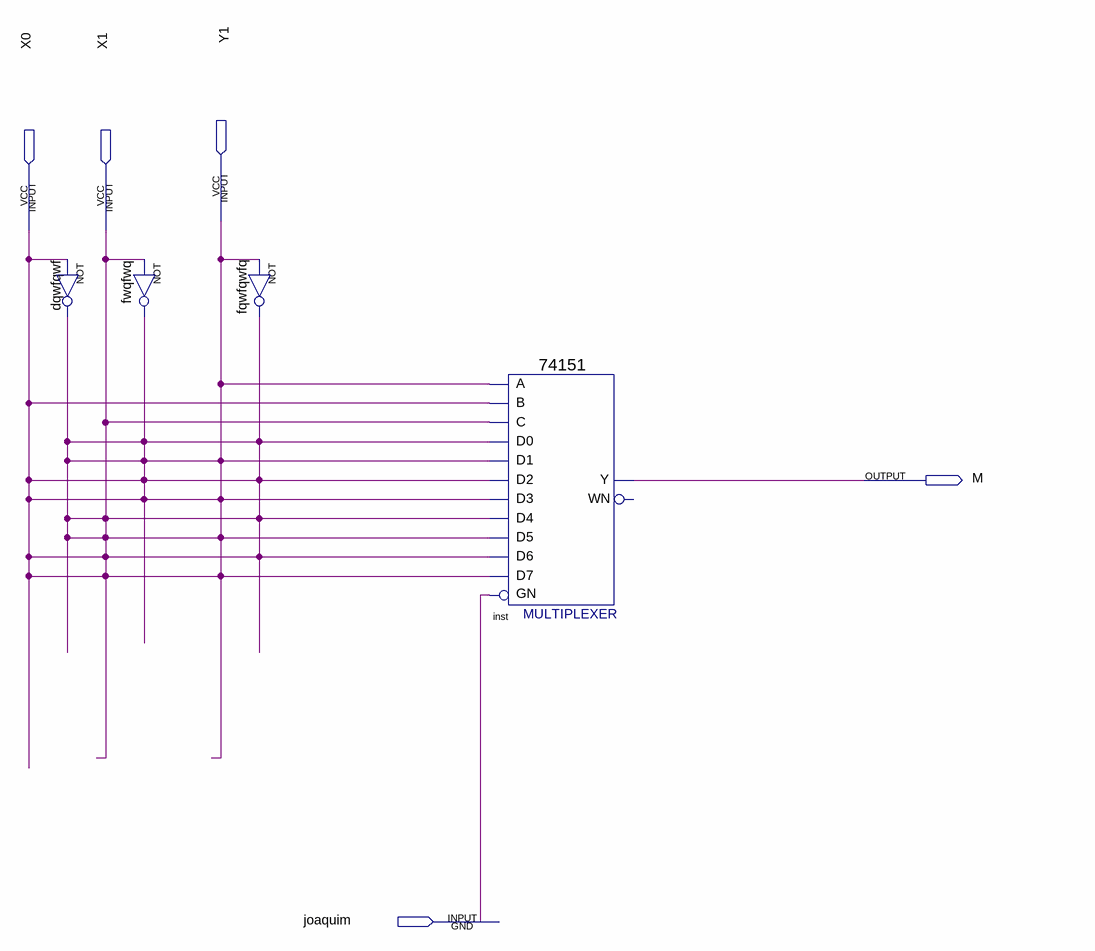
[diagram p0: schematic sheet]
// Quartus schematic Block2.bdf as structural Verilog: 4 symbols, 5 pins
module Block2 (
  input  Y1,
  input  X0,
  input  X1,
  input  joaquim,
  output M
);

  not dqwfqwf (X0, X0);
  not fwqfwq (X0, X0);
  not fqwfqwfq (X0, X0);
  \74151  inst (
    .GN(joaquim), .C(X0), .B(X0), .A(X0), .D5(X0), .D0(X0), .D1(X0), .D4(X0), .D3(X0), .D2(X0), .D6(X0),
    .D7(X0), .Y(M));  // open: WN

  assign X1 = X0;
  assign Y1 = X0;
endmodule
